# EAGLE schematic BT10_Rev2 (EAGLE 6.5.0)
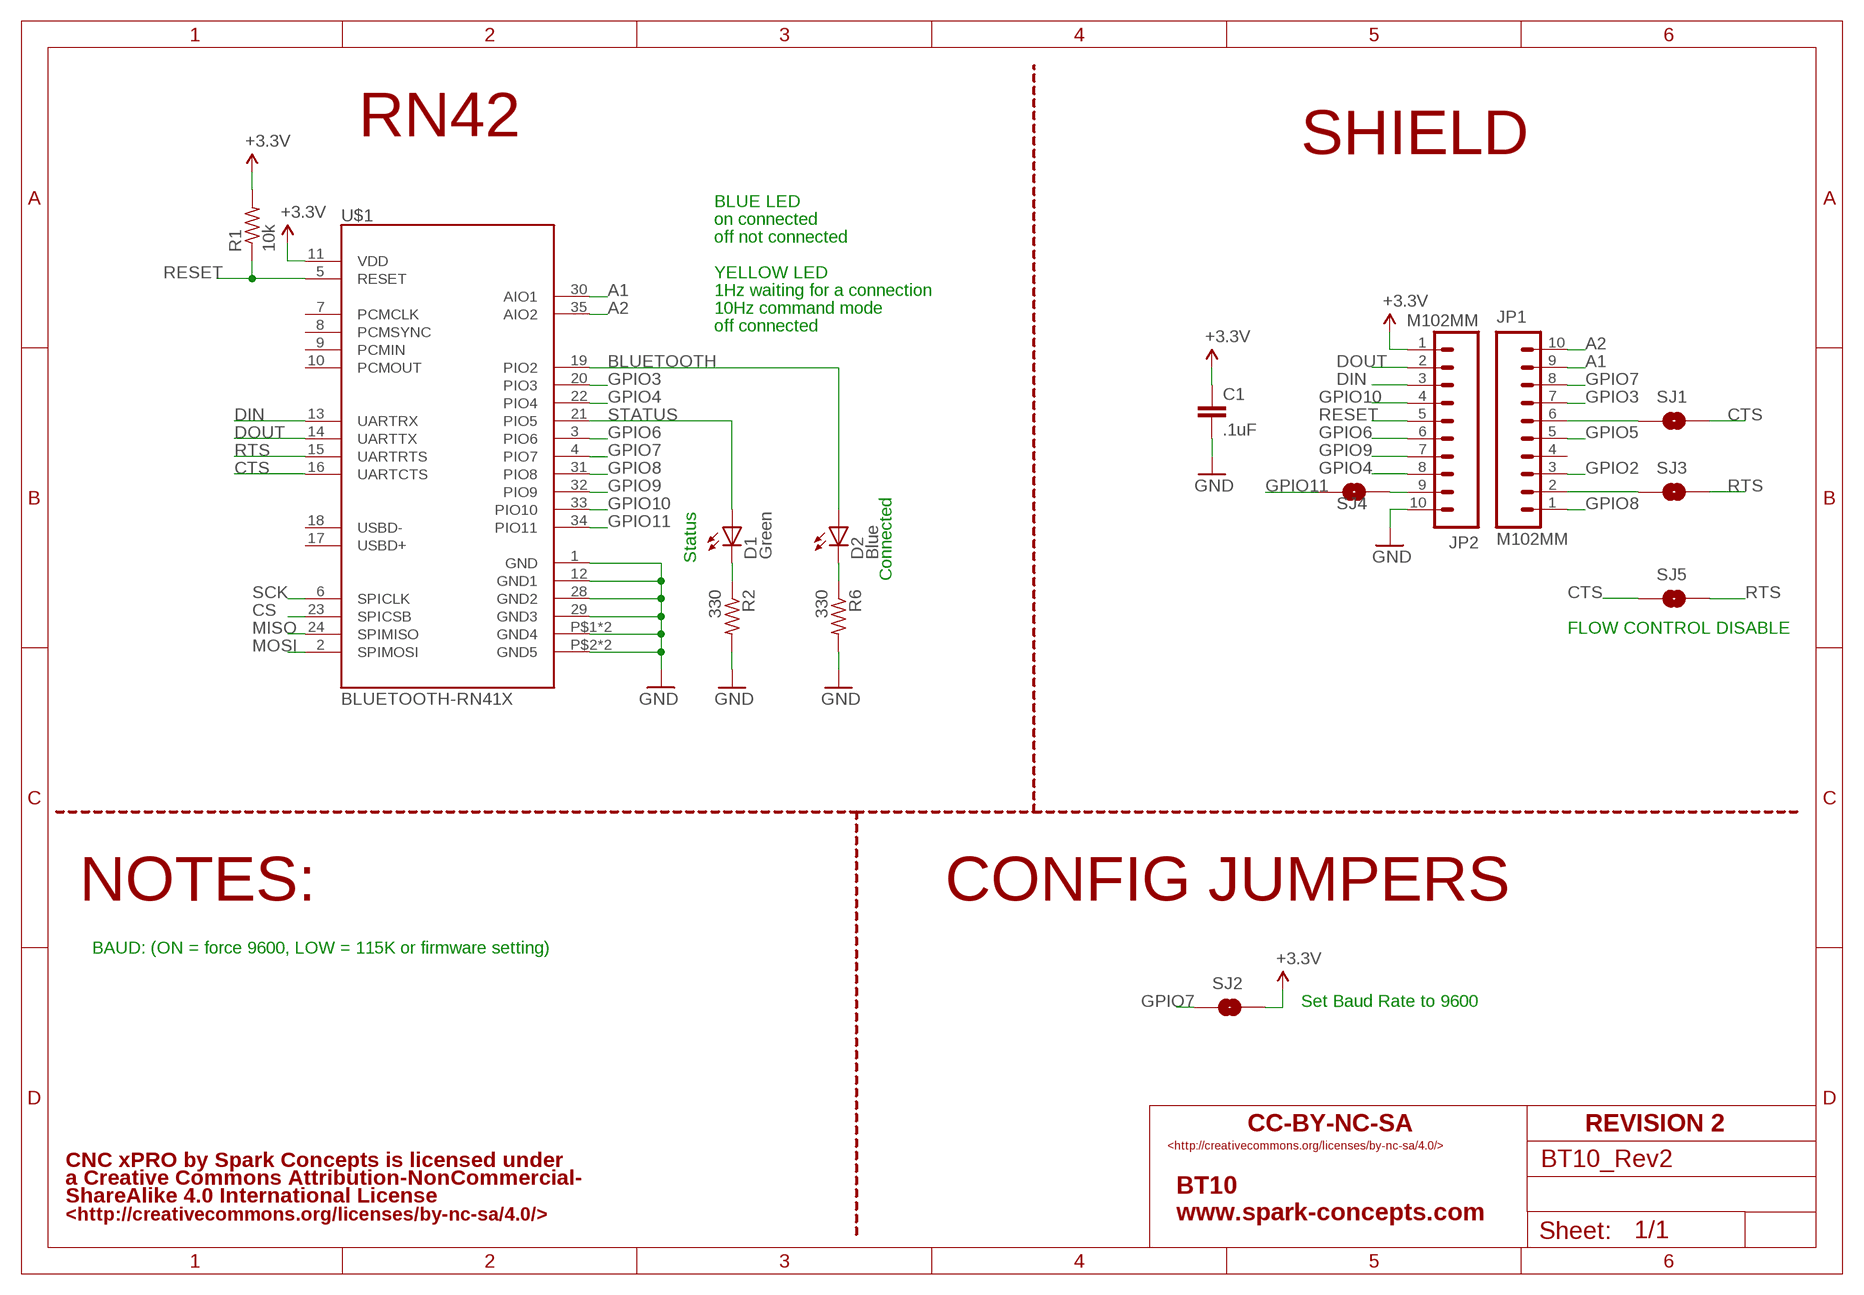
[diagram p0: schematic, sheet 1]

## Parts
C1  .1uF  CAP0603-CAP  [0603-CAP]
D1  Green  LED0603  [LED-0603]
D2  Blue  LED0603  [LED-0603]
JP1  M102MM  [1X10-2MM]
JP2  M102MM  [1X10-2MM]
R1  10k  R-US_R0603  [R0603]
R2  330  R-US_R0603  [R0603]
R6  330  R-US_R0603  [R0603]
SJ1  SOLDERJUMPERNO  [SJ_2S-NO]
SJ2  SOLDERJUMPERNC2  [SJ_2S-NOTRACE]
SJ3  SOLDERJUMPERNO  [SJ_2S-NO]
SJ4  SOLDERJUMPERNO  [SJ_2S-NO]
SJ5  SOLDERJUMPERNC2  [SJ_2S-NOTRACE]
U$1  BLUETOOTH-RN41X  [RN41_NO_ANT]

## Nets
A1: JP1.9 U$1.30(AIO1)
A2: JP1.10 U$1.35(AIO2)
BLUETOOTH: D2.A U$1.19(PIO2)
CS: U$1.23(SPICSB)
CTS: SJ1.2 SJ5.1 U$1.16(UARTCTS)
D1: D1.C R2.1
D2: D2.C R6.1
DIN: JP2.3 U$1.13(UARTRX)
DOUT: JP2.2 U$1.14(UARTTX)
GND: C1.2 JP2.10 R2.2 R6.2 U$1.1(GND) U$1.12(GND1) U$1.28(GND2) U$1.29(GND3) U$1.P$1(GND4) U$1.P$2(GND5) U$1.P$3(GND5) U$1.P$4(GND4)
GPIO2: JP1.3
GPIO3: JP1.7 U$1.20(PIO3)
GPIO4: JP2.8 U$1.22(PIO4)
GPIO5: JP1.5
GPIO6: JP2.6 U$1.3(PIO6)
GPIO7: JP1.8 SJ2.1 U$1.4(PIO7)
GPIO8: JP1.1 U$1.31(PIO8)
GPIO9: JP2.7 U$1.32(PIO9)
GPIO10: JP2.4 U$1.33(PIO10)
GPIO11: SJ4.1 U$1.34(PIO11)
MISO: U$1.24(SPIMISO)
MOSI: U$1.2(SPIMOSI)
N$1: JP1.6 SJ1.1
N$2: JP1.2 SJ3.1
N$3: JP2.9 SJ4.2
RESET: JP2.5 R1.1 U$1.5(RESET)
RTS: SJ3.2 SJ5.2 U$1.15(UARTRTS)
SCK: U$1.6(SPICLK)
STATUS: D1.A U$1.21(PIO5)
VCC: C1.1 JP2.1 R1.2 SJ2.2 U$1.11(VDD) ; supply symbol labelled +3.3V
Unconnected: JP1.4 U$1.7(PCMCLK) U$1.8(PCMSYNC) U$1.9(PCMIN) U$1.10(PCMOUT) U$1.17(USBD+) U$1.18(USBD-)

## Notes on the sheet
- RN42 | SHIELD
- BLUE LED
- on connected
- off not connected
- YELLOW LED
- 1Hz waiting for a connection
- 10Hz command mode
- off connected
- Status
- Connected
- FLOW CONTROL DISABLE
- NOTES: | CONFIG JUMPERS
- BAUD: (ON = force 9600, LOW = 115K or firmware setting)
- Set Baud Rate to 9600
- CC-BY-NC-SA | REVISION 2
- <http://creativecommons.org/licenses/by-nc-sa/4.0/>
- CNC xPRO by Spark Concepts is licensed under
- a Creative Commons Attribution-NonCommercial-
- BT10
- ShareAlike 4.0 International License
- <http://creativecommons.org/licenses/by-nc-sa/4.0/> | www.spark-concepts.com

## Library data of the parts
C1 = SparkFun-Passives:CAP: Capacitor Standard 0603 ceramic capacitor, and 0.1" leaded capacitor.
D1 D2 = SparkFun:LED: LEDs Standard schematic elements and footprints for 5mm, 3mm, 1206, and 0603 sized LEDs. 5mm - Spark Fun Electronics SKU : COM-00529 (and others)
JP1 JP2 = SparkFun:M10: Header 10 Standard 10-pin 0.1" header. Use with straight break away headers (SKU : PRT-00116), right angle break away headers (PRT-00553), swiss pins (PRT-00743), machine pins (PRT-00117), and female headers (PRT-00115).
R1 R2 R6 = resistor:R-US_: RESISTOR, American symbol
SJ1-SJ5 = SparkFun:SOLDERJUMPER: Solder Jumper Standard SMD solder jumper. Used to automate production. Two varients : Normally Open and Normally Closed are the same, but have different paste layers. NC will have a large amount of paste and should jumper during reflow.
U$1 = SparkFun:BLUETOOTH-RN41X

## Net classes
1 power: width 0.254 mm, drill 0.61 mm, clearance 0.254 mm
2 gnd: width 0.254 mm, drill 0.61 mm, clearance 0.254 mm